# Altium project vestibular_vampire.PrjPcb (part 3 of 3)
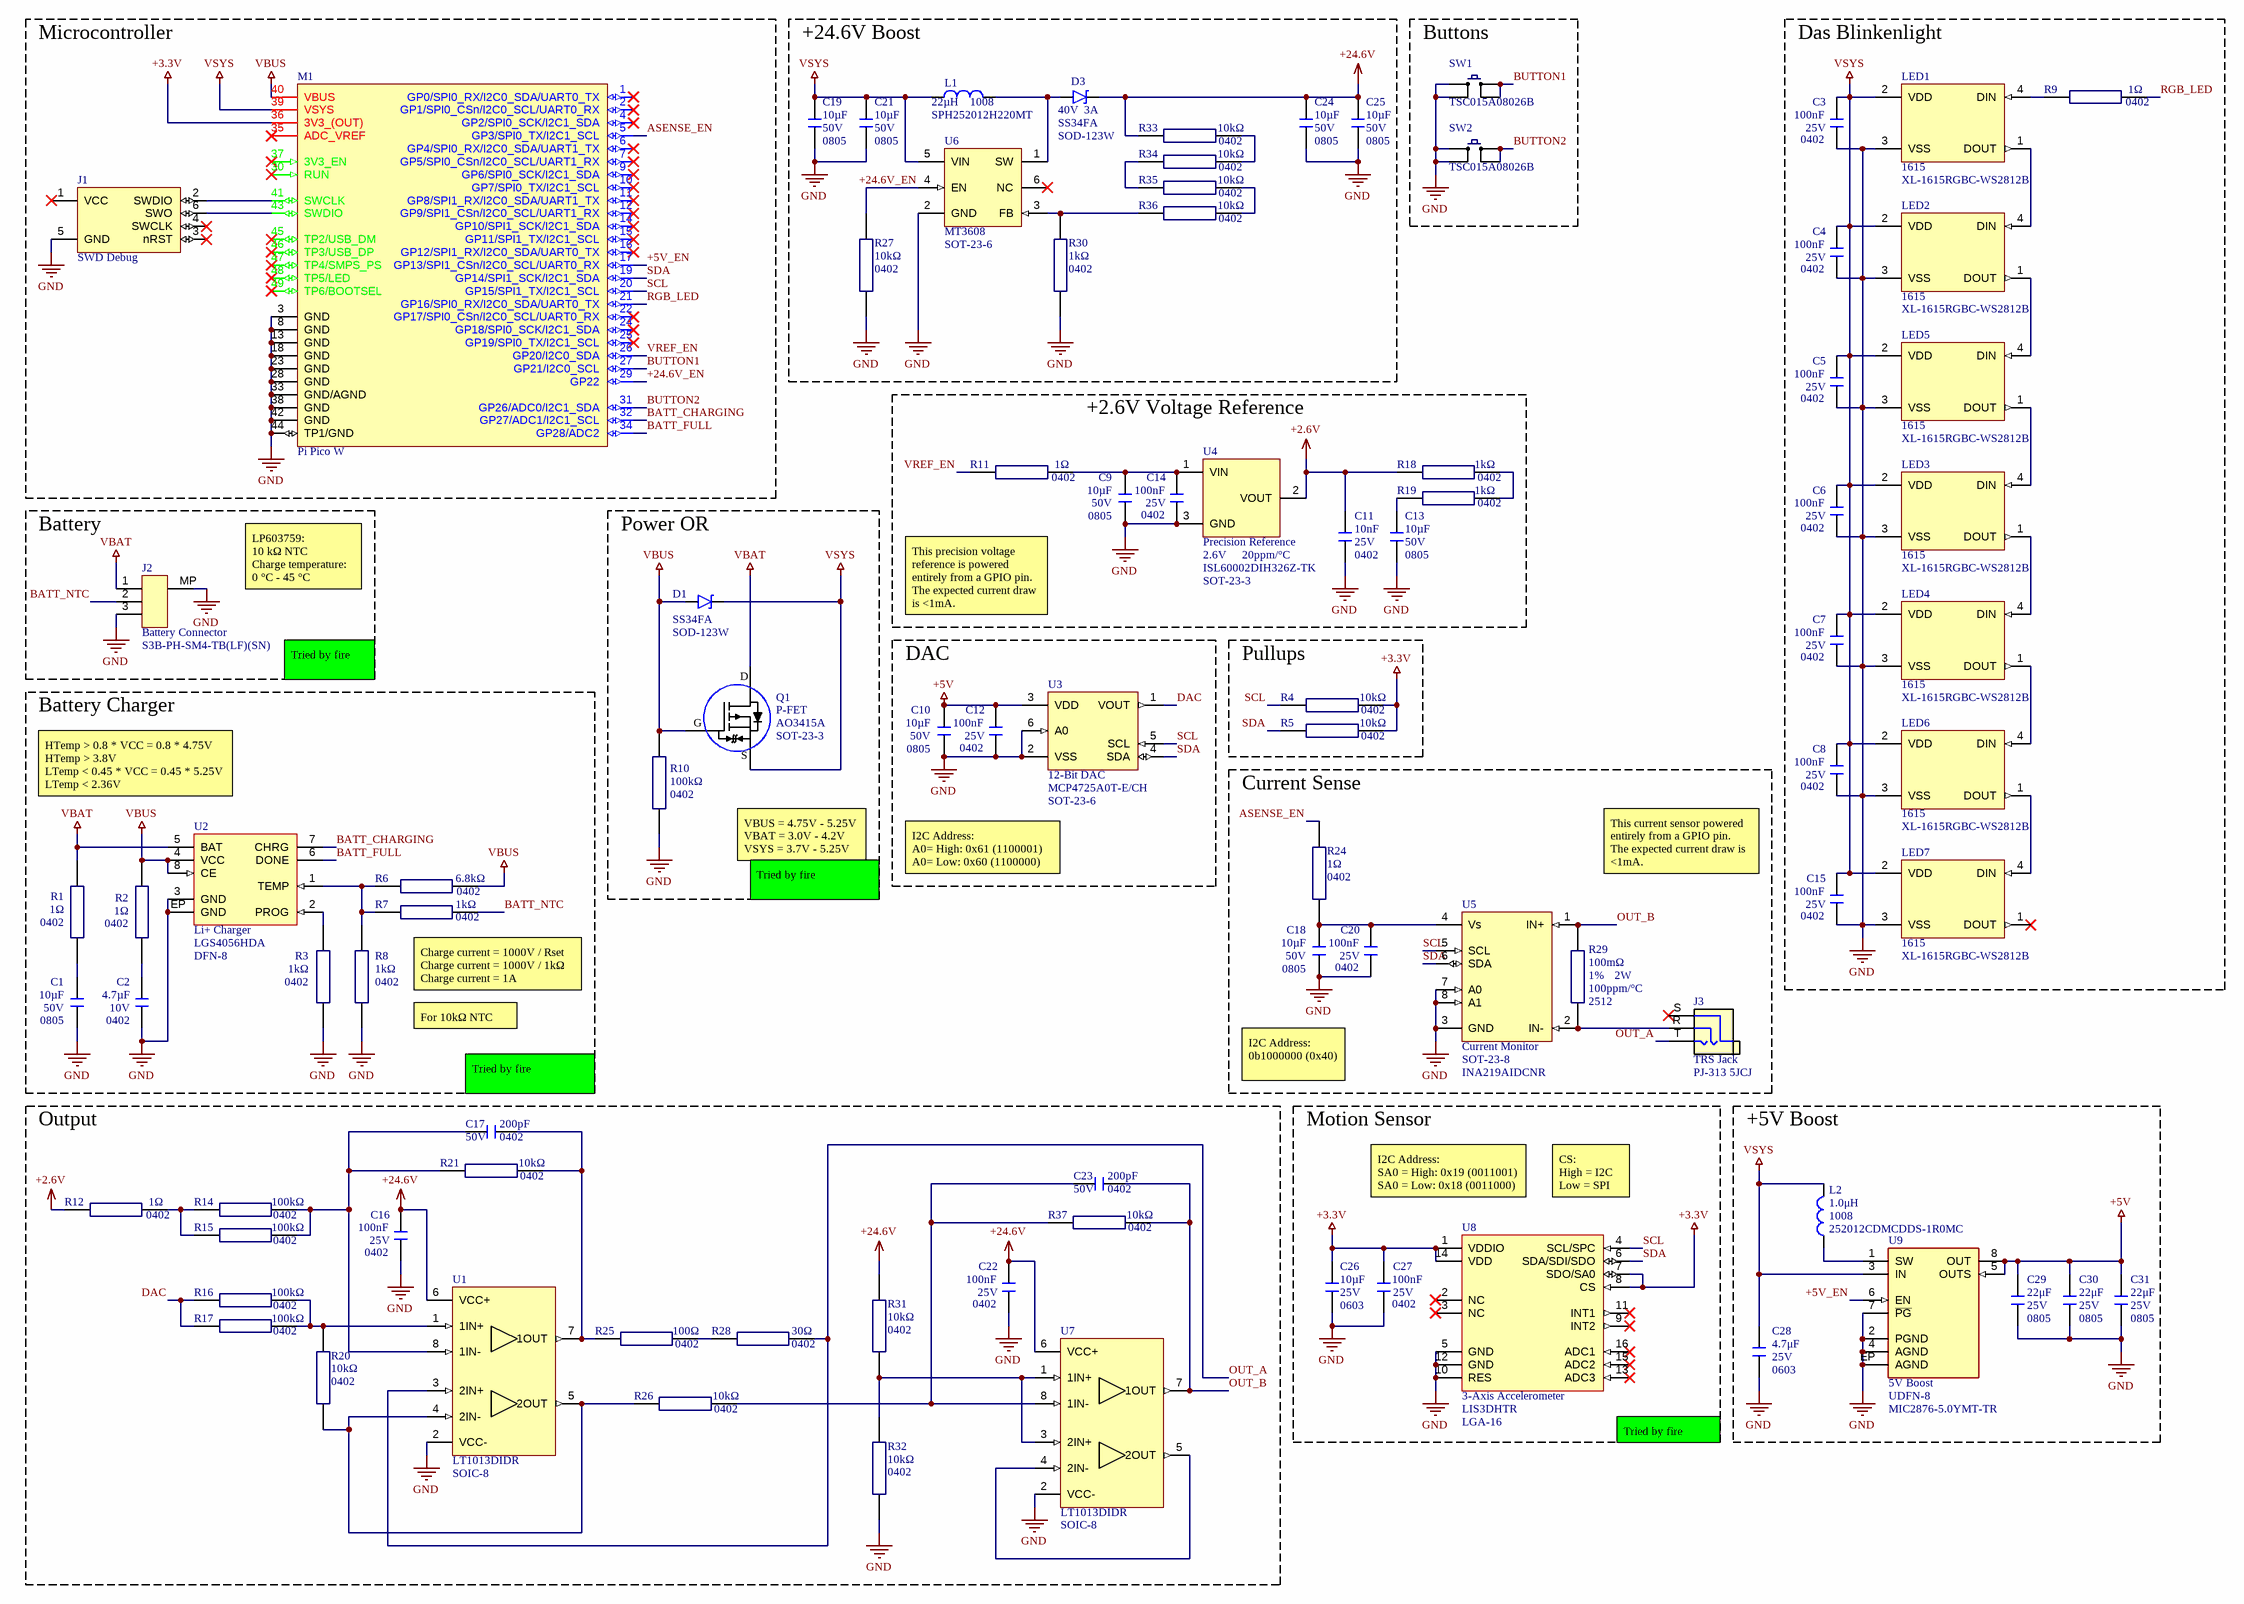
[diagram p2: vestibular_vampire.SchDoc]

## Sheet vestibular_vampire.SchDoc: Vestibular Vampire (continued)

### Library data of the parts (continued)
U1 U7 = LT1013DIDR: Op-Amp, 5-44 V, SOIC-8; Manufacturer: Texas Instruments; Manufacturer Lifecycle Status: ACTIVE; Bandwidth: 1MHz; Common Mode Rejection Ratio: 97dB; Input Bias Current: -15nA; Input Offset Voltage (Vos): 200µV; Max Dual Supply Voltage: 22V; Max Junction Temperature (Tj): 150°C; Max Supply Voltage: 30V; Min Dual Supply Voltage: 2V; Min Supply Voltage: 5V; Nominal Supply Current: 350µA; Number of Amplifiers: 2; Output Current per Channel: 25mA; Slew Rate: 0.4V/µs; Voltage Gain: 120dB; Supplier 1: LCSC; RoHS: Compliant; Category: Amplifiers - Op Amps, Buffer, Instrumentation; Stock 1: 2755; Pricing 1: 1=10.5871, 1=1.2745, 1=11.5575, 1=1.4483, 10=8.8042, 10=1.0599, 10=9.6112, 10=1.2044, 30=7.8217, 30=0.9416, 30=8.5386, 30=1.07, 100=6.7048, 100=0.8072, 100=7.3193, 100=0.9172, 500=6.2077, 500=0.7473, 500=6.7767, 500=0.8492, 1000=5.9935, 1000=0.7216, 1000=6.5428, 1000=0.8199 (CNY); Ambient Temperature Range High: 105°C; Contact Plating: Gold; Gain Bandwidth Product: 1MHz; Height: 1.75mm; Lead Free: Lead Free; Length: 4.9mm; Lifecycle Status: Production; Max Operating Temperature: 105°C; Min Operating Temperature: -40°C; Mounting Technology: Surface Mount; Number of Channels: 2; Number of Circuits: 2; Number of Elements: 2; Pins: 8; Operating Supply Current: 350µA; Operating Supply Voltage: 22V; Packaging: Cut Tape; Radiation Hardening: No; REACH SVHC: No; Schedule B: 8542330000, 8542330000|8542330000|8542330000|8542330000|8542330000; Thickness: 1.58mm; Width: 3.91mm; ComponentLink1URL: https://octopart.com:443/opatz8j6/c1?t=M0cShFGUicegvLtuJ8-zs80pXCwKzPiMDfXh6-JTafKhOGkvmMbrbDOg59FWK180Hgcjh15YrgijTlzM1MQuPq40am12GMlhmTgFy1qRP_KCXoXJDs106NH1KBLm8tXuipKWnQXtF43MTIKlBHKkohhW4hOkcw2aK72GO3jP4nGAq-PKP9ZyrZWAbdm3b52rhLG0hkAVfGKswW3joJ7vh5DhYPJWbTvPhAbR8fO8VPXhxLQM_jY_VT1wzAmnyheMOpOCMWHZ9EDcKaKFaiylEQig-uIOmFPvjOgFNBLduZO8eK__Uds4HhdSl55DCMz9u54MsLGNxZV-EWbAqBfnwHirGA5M-fHWLMAxe_jbIe9TaaBizE_qMUTQwbY40qDj2r7m&src-supplier=Texas+Instruments; ComponentLink1Description: https://octopart.com:443/opatz8j6/c1?t=M0cShFGUicegvLtuJ8-zs80pXCwKzPiMDfXh6-JTafKhOGkvmMbrbDOg59FWK180Hgcjh15YrgijTlzM1MQuPq40am12GMlhmTgFy1qRP_KCXoXJDs106NH1KBLm8tXuipKWnQXtF43MTIKlBHKkohhW4hOkcw2aK72GO3jP4nGAq-PKP9ZyrZWAbdm3b52rhLG0hkAVfGKswW3joJ7vh5DhYPJWbTvPhAbR8fO8VPXhxLQM_jY_VT1wzAmnyheMOpOCMWHZ9EDcKaKFaiylEQig-uIOmFPvjOgFNBLduZO8eK__Uds4HhdSl55DCMz9u54MsLGNxZV-EWbAqBfnwHirGA5M-fHWLMAxe_jbIe9TaaBizE_qMUTQwbY40qDj2r7m&src-supplier=Texas+Instruments; ComponentLink2URL: https://datasheet.octopart.com:443/LT1013DIDR-Texas-Instruments-datasheet-41214033.pdf?src-supplier=Texas+Instruments; ComponentLink2Description: https://datasheet.octopart.com:443/LT1013DIDR-Texas-Instruments-datasheet-41214033.pdf?src-supplier=Texas+Instruments; ComponentLink3URL: https://datasheet.octopart.com:443/LT1013DIDR-Texas-Instruments-datasheet-10254874.pdf?src-supplier=Texas+Instruments; ComponentLink3Description: https://datasheet.octopart.com:443/LT1013DIDR-Texas-Instruments-datasheet-10254874.pdf?src-supplier=Texas+Instruments; ComponentLink4URL: https://sigma.octopart.com:443/49249642/technical_drawing/Texas-Instruments-LT1013DIDR.pdf?src-supplier=Texas+Instruments; ComponentLink4Description: https://sigma.octopart.com:443/49249642/technical_drawing/Texas-Instruments-LT1013DIDR.pdf?src-supplier=Texas+Instruments; ComponentLink5URL: https://datasheet.octopart.com:443/LT1013DIDR-Texas-Instruments-datasheet-10254053.pdf?src-supplier=Texas+Instruments; ComponentLink5Description: https://datasheet.octopart.com:443/LT1013DIDR-Texas-Instruments-datasheet-10254053.pdf?src-supplier=Texas+Instruments; ComponentLink6URL: https://datasheet.octopart.com:443/LT1013DIDR-Texas-Instruments-datasheet-148846.pdf?src-supplier=Texas+Instruments; ComponentLink6Description: https://datasheet.octopart.com:443/LT1013DIDR-Texas-Instruments-datasheet-148846.pdf?src-supplier=Texas+Instruments; ComponentLink7URL: https://datasheet.octopart.com:443/LT1013DIDR-Texas-Instruments-datasheet-151281.pdf?src-supplier=Texas+Instruments; ComponentLink7Description: https://datasheet.octopart.com:443/LT1013DIDR-Texas-Instruments-datasheet-151281.pdf?src-supplier=Texas+Instruments; ComponentLink8URL: https://datasheet.octopart.com:443/LT1013DIDR-Texas-Instruments-datasheet-148794836.pdf?src-supplier=Upverter; ComponentLink8Description: https://datasheet.octopart.com:443/LT1013DIDR-Texas-Instruments-datasheet-148794836.pdf?src-supplier=Upverter; ComponentLink9URL: https://datasheet.octopart.com:443/LT1013DIDR-Texas-Instruments-datasheet-82285550.pdf?src-supplier=element14+APAC; ComponentLink9Description: https://datasheet.octopart.com:443/LT1013DIDR-Texas-Instruments-datasheet-82285550.pdf?src-supplier=element14+APAC; ComponentLink10URL: https://datasheet.octopart.com:443/LT1013DIDR.-Texas-Instruments-datasheet-33010526.pdf?src-supplier=element14+APAC; ComponentLink10Description: https://datasheet.octopart.com:443/LT1013DIDR.-Texas-Instruments-datasheet-33010526.pdf?src-supplier=element14+APAC; ComponentLink11URL: https://datasheet.octopart.com:443/LT1013DIDR-Texas-Instruments-datasheet-20866108.pdf?src-supplier=Newark; ComponentLink11Description: https://datasheet.octopart.com:443/LT1013DIDR-Texas-Instruments-datasheet-20866108.pdf?src-supplier=Newark; ComponentLink12URL: https://datasheet.octopart.com:443/LT1013DIDR-Texas-Instruments-datasheet-11521414.pdf?src-supplier=Newark; ComponentLink12Description: https://datasheet.octopart.com:443/LT1013DIDR-Texas-Instruments-datasheet-11521414.pdf?src-supplier=Newark; ComponentLink13URL: https://datasheet.octopart.com:443/LT1013DIDR-Texas-Instruments-datasheet-14138854.pdf?src-supplier=iiiC; ComponentLink13Description: https://datasheet.octopart.com:443/LT1013DIDR-Texas-Instruments-datasheet-14138854.pdf?src-supplier=iiiC; ComponentLink14URL: https://datasheet.octopart.com:443/LT1013DIDR-Texas-Instruments-datasheet-14436488.pdf?src-supplier=Factory+Futures; ComponentLink14Description: https://datasheet.octopart.com:443/LT1013DIDR-Texas-Instruments-datasheet-14436488.pdf?src-supplier=Factory+Futures; ComponentLink15URL: https://datasheet.octopart.com:443/LT1013DIDR-Texas-Instruments-datasheet-8205012.pdf?src-supplier=Jameco; ComponentLink15Description: https://datasheet.octopart.com:443/LT1013DIDR-Texas-Instruments-datasheet-8205012.pdf?src-supplier=Jameco; ComponentLink16URL: https://datasheet.octopart.com:443/LT1013DIDR-Texas-Instruments-datasheet-9056.pdf?src-supplier=DigiKey; ComponentLink16Description: https://datasheet.octopart.com:443/LT1013DIDR-Texas-Instruments-datasheet-9056.pdf?src-supplier=DigiKey; ComponentLink17URL: http://sigma.octopart.com:80/conflict_mineral_statement/Texas-Instruments-company-63.pdf?src-supplier=Compliance+Statements; ComponentLink17Description: http://sigma.octopart.com:80/conflict_mineral_statement/Texas-Instruments-company-63.pdf?src-supplier=Compliance+Statements; ComponentLink18URL: http://sigma.octopart.com:80/reach_statement/Texas-Instruments-company-64.pdf?src-supplier=Compliance+Statements; ComponentLink18Description: http://sigma.octopart.com:80/reach_statement/Texas-Instruments-company-64.pdf?src-supplier=Compliance+Statements; Supplier Part Number 1: C177140; Manufacturer Part Number: LT1013DIDR
U2 = LGS4056H: Battery Charger, DFN-8(2x2); Case/Package: DFN-8(2x2); Supplier 1: LCSC; house_part_number: LGS4056HDA; Supplier Part Number 1: C5124109
U3 = MCP4725A0T-E/CH: DAC, 12-bit, SOT-23-6; Manufacturer: Microchip; Manufacturer Package Identifier: C04-028-CHY; Input Offset Voltage (Vos): 1.1mV; Integral Nonlinearity (INL): 14.5LSB; Interface: I2C; Max Junction Temperature (Tj): 150°C; Max Supply Voltage: 5.5V; Min Supply Voltage: 2.7V; Nominal Supply Current: 210µA; Number of Bits: 12; Number of Channels: 1; Output Type: Voltage; Polarity: Unipolar; Resolution: 1.5B; Settling Time: 6µs; Supply Type: Single; Supplier 1: LCSC; RoHS: Compliant; Category: Digital to Analog Converters (DACs); Stock 1: 11398; Pricing 1: 1=6.7252, 1=0.8004, 1=7.3416, 1=0.92, 10=5.9073, 10=0.7031, 10=6.4487, 10=0.8081, 30=5.1339, 30=0.611, 30=5.6044, 30=0.7023, 100=4.5622, 100=0.543, 100=4.9804, 100=0.6241, 500=4.3268, 500=0.515, 500=4.7234, 500=0.5919, 1000=4.2033, 1000=0.5003, 1000=4.5885, 1000=0.575 (CNY); Projected EOL Date: 2034-10-26; Ambient Temperature Range High: 125°C; Contact Plating: Tin; Country of Assembly: Thailand; Country of Fabrication: United States of America; Country of Origin: Thailand; Export Control Classification Number (ECCN) Code: EAR99; Height: 1.45mm; Harmonized Tariff Schedule (HTS) Code: 8542.39.0040; Introduction Date: 2007-10-26; Lead Free: Lead Free; Length: 3.1mm; Lifecycle Status: Production; Max Operating Temperature: 125°C; Min Operating Temperature: -40°C; Mounting Technology: Surface Mount; Number of Converters: 1; Number of D/A Converters: 1; Number of DAC Channels: 1; Number of Outputs: 1; Pins: 6; Packaging: Cut Tape; Radiation Hardening: No; REACH SVHC: No; Schedule B: 8542390000, 8542390000|8542390000|8542390000|8542390000|8542390000; Termination: SMD/SMT; Width: 1.8mm; ComponentLink1URL: https://datasheet.octopart.com:443/MCP4725A0T-E/CH-Microchip-datasheet-11052695.pdf?src-supplier=SHENGYU+ELECTRONICS; ComponentLink1Description: https://datasheet.octopart.com:443/MCP4725A0T-E/CH-Microchip-datasheet-11052695.pdf?src-supplier=SHENGYU+ELECTRONICS; ComponentLink2URL: https://datasheet.octopart.com:443/MCP4725A0T-E/CH-Microchip-datasheet-660622.pdf?src-supplier=Electro+Sonic; ComponentLink2Description: https://datasheet.octopart.com:443/MCP4725A0T-E/CH-Microchip-datasheet-660622.pdf?src-supplier=Electro+Sonic; ComponentLink3URL: https://datasheet.octopart.com:443/MCP4725A0T-E-CH-Microchip-datasheet-175858725.pdf?src-supplier=Microchip; ComponentLink3Description: https://datasheet.octopart.com:443/MCP4725A0T-E-CH-Microchip-datasheet-175858725.pdf?src-supplier=Microchip; ComponentLink4URL: https://datasheet.octopart.com:443/MCP4725A0T-E-CH-Microchip-datasheet-140568178.pdf?src-supplier=Arrow.cn; ComponentLink4Description: https://datasheet.octopart.com:443/MCP4725A0T-E-CH-Microchip-datasheet-140568178.pdf?src-supplier=Arrow.cn; ComponentLink5URL: https://datasheet.octopart.com:443/MCP4725A0T-E-CH-Microchip-datasheet-166018867.pdf?src-supplier=Augswan; ComponentLink5Description: https://datasheet.octopart.com:443/MCP4725A0T-E-CH-Microchip-datasheet-166018867.pdf?src-supplier=Augswan; ComponentLink6URL: http://sigma.octopart.com:80/188449425/materials_sheet/Microchip-MCP4725A0T-E-CH.pdf?src-supplier=Compliance+Statements; ComponentLink6Description: http://sigma.octopart.com:80/188449425/materials_sheet/Microchip-MCP4725A0T-E-CH.pdf?src-supplier=Compliance+Statements; ComponentLink7URL: http://sigma.octopart.com:80/conflict_mineral_statement/Microchip-company-68.pdf?src-supplier=Compliance+Statements; ComponentLink7Description: http://sigma.octopart.com:80/conflict_mineral_statement/Microchip-company-68.pdf?src-supplier=Compliance+Statements; ComponentLink8URL: http://sigma.octopart.com:80/conflict_mineral_statement/Microchip-company-69.pdf?src-supplier=Compliance+Statements; ComponentLink8Description: http://sigma.octopart.com:80/conflict_mineral_statement/Microchip-company-69.pdf?src-supplier=Compliance+Statements; ComponentLink9URL: http://sigma.octopart.com:80/reach_statement/Microchip-company-70.pdf?src-supplier=Compliance+Statements; ComponentLink9Description: http://sigma.octopart.com:80/reach_statement/Microchip-company-70.pdf?src-supplier=Compliance+Statements; ComponentLink10URL: http://sigma.octopart.com:80/rohs_statement/Microchip-company-71.pdf?src-supplier=Compliance+Statements; ComponentLink10Description: http://sigma.octopart.com:80/rohs_statement/Microchip-company-71.pdf?src-supplier=Compliance+Statements; Supplier Part Number 1: C144198; Manufacturer Part Number: MCP4725A0T-E/CH
U4 = ISL60002DIH326Z-TK: 2.6 V, ±5.0mV, 20ppm/°C, 7 mA Precision Voltage Reference, SOT-23-3; Manufacturer: Renesas; Manufacturer Lifecycle Status: ACTIVE; Max Supply Voltage: 5.5V; Max Output current: 7mA; Max Supply Current: 900nA; Min Input Voltage: 2.8V; Min Output Voltage: -2.4V; Number of Circuits: 1; Operating Supply Voltage: 3V; Output Type: Fixed; Pitch: 0m; Reference Type: Series; Tolerance: 0.19%; Supplier 1: LCSC; RoHS: Compliant; Category: Voltage References; Stock 1: 50; Pricing 1: 1=17.1493, 1=2.0645, 1=18.7211, 1=2.346, 10=16.7772, 10=2.0197, 10=18.3149, 10=2.2951, 30=16.5287, 30=1.9898, 30=18.0436, 30=2.2611, 100=16.2801, 100=1.9599, 100=17.7723, 100=2.2271 (CNY); Export Control Classification Number (ECCN) Code: EAR99; Part Family: ISL60002DIH326; Height: 0m; Height - Seated (Max): 1.12mm; Harmonized Tariff Schedule (HTS) Code: 8540000000; Length: 2.9mm; Lifecycle Status: Production; Max Operating Temperature: 85°C; Max Output Voltage: 2.6V; Min Operating Temperature: -40°C; Min Supply Voltage: 2.8V; MSL: 1; Mounting Technology: Surface Mount; Nominal Output Voltage: 2.6V; Number of Outputs: 1; Pins: 3; Number of Terminals: 3; Operating Supply Current: 900nA; Output Current: 7mA; Output Voltage: 2.6V; Radiation Hardening: No; REACH SVHC: Yes; Terminal Pitch: 950µm; Width: 1.3mm; ComponentLink1URL: https://datasheet.octopart.com:443/ISL60002DIH326Z-TK-Renesas-datasheet-181194884.pdf?src-supplier=IHS; ComponentLink1Description: https://datasheet.octopart.com:443/ISL60002DIH326Z-TK-Renesas-datasheet-181194884.pdf?src-supplier=IHS; ComponentLink2URL: https://datasheet.octopart.com:443/ISL60002DIH326Z-TK-Intersil-datasheet-93396614.pdf?src-supplier=IHS; ComponentLink2Description: https://datasheet.octopart.com:443/ISL60002DIH326Z-TK-Intersil-datasheet-93396614.pdf?src-supplier=IHS; ComponentLink3URL: https://datasheet.octopart.com:443/ISL60002DIH326Z-TK-Renesas-datasheet-179182157.pdf?src-supplier=Integrated+Device+Technology; ComponentLink3Description: https://datasheet.octopart.com:443/ISL60002DIH326Z-TK-Renesas-datasheet-179182157.pdf?src-supplier=Integrated+Device+Technology; ComponentLink4URL: https://datasheet.octopart.com:443/ISL60002DIH326Z-TK-Renesas-datasheet-149187340.pdf?src-supplier=Integrated+Device+Technology; ComponentLink4Description: https://datasheet.octopart.com:443/ISL60002DIH326Z-TK-Renesas-datasheet-149187340.pdf?src-supplier=Integrated+Device+Technology; ComponentLink5URL: https://datasheet.octopart.com:443/ISL60002DIH326Z-TK-Renesas-datasheet-137927834.pdf?src-supplier=Renesas; ComponentLink5Description: https://datasheet.octopart.com:443/ISL60002DIH326Z-TK-Renesas-datasheet-137927834.pdf?src-supplier=Renesas; ComponentLink6URL: https://datasheet.octopart.com:443/ISL60002DIH326Z-TK-Intersil-datasheet-11480143.pdf?src-supplier=Newark; ComponentLink6Description: https://datasheet.octopart.com:443/ISL60002DIH326Z-TK-Intersil-datasheet-11480143.pdf?src-supplier=Newark; ComponentLink7URL: https://datasheet.octopart.com:443/ISL60002DIH326Z-TK-Renesas-datasheet-23692053.pdf?src-supplier=Future+Electronics; ComponentLink7Description: https://datasheet.octopart.com:443/ISL60002DIH326Z-TK-Renesas-datasheet-23692053.pdf?src-supplier=Future+Electronics; ComponentLink8URL: http://sigma.octopart.com:80/conflict_mineral_statement/Renesas-company-44.pdf?src-supplier=Compliance+Statements; ComponentLink8Description: http://sigma.octopart.com:80/conflict_mineral_statement/Renesas-company-44.pdf?src-supplier=Compliance+Statements; ComponentLink9URL: http://sigma.octopart.com:80/reach_statement/Renesas-company-45.pdf?src-supplier=Compliance+Statements; ComponentLink9Description: http://sigma.octopart.com:80/reach_statement/Renesas-company-45.pdf?src-supplier=Compliance+Statements; Supplier Part Number 1: C152385; Manufacturer Part Number: ISL60002DIH326Z-TK
U5 = INA219AIDCNR: 12-bit, 26 V, Current monitor, SOT-23-8; Manufacturer: Texas Instruments; Manufacturer Lifecycle Status: ACTIVE; Accuracy: 1%; Bandwidth: 3.4MHz; Common Mode Rejection Ratio: 100dB; Input Offset Voltage (Vos): 100µV; Max Supply Voltage: 26V; Max Junction Temperature (Tj): 150°C; Max Supply Current: 5mA; Min Input Voltage: 0V; Min Supply Voltage: 3V; Nominal Supply Current: 700µA; Number of Amplifiers: 1; Operating Supply Current: 1mA; Output Current: 10mA; Output Type: Digital; Supplier 1: LCSC; RoHS: Compliant; Category: Amplifiers - Op Amps, Buffer, Instrumentation; Stock 1: 20380; Pricing 1: 1=4.0454, 1=0.4815, 1=4.4162, 1=0.5534, 10=3.3809, 10=0.4024, 10=3.6908, 10=0.4625, 30=2.9072, 30=0.346, 30=3.1737, 30=0.3977, 100=2.5132, 100=0.2992, 100=2.7436, 100=0.3438, 500=2.389, 500=0.2844, 500=2.6079, 500=0.3268, 1000=2.3217, 1000=0.2764, 1000=2.5345, 1000=0.3176 (CNY); Ambient Temperature Range High: 85°C; Contact Plating: Gold; Features: I²C; Height: 1.45mm; Lead Free: Lead Free; Length: 2.9mm; Lifecycle Status: Production; Max Operating Temperature: 125°C; Min Operating Temperature: -40°C; Number of Outputs: 1; Pins: 8; Output Current per Channel: 10mA; Packaging: Cut Tape; Quiescent Current: 700µA; Radiation Hardening: No; REACH SVHC: No; Schedule B: 8542330000|8542330000|8542330000, 8542330000|8542330000|8542330000|8542330000|8542330000; Thickness: 1.1mm; Weight: 40.001177mg; Width: 1.63mm; ComponentLink1URL: https://octopart.com:443/opatz8j6/c1?t=DVq09uJr_YdfZ3FRpbOBgPun56EVh337pP3YmMsMgBQtNH6hRcAHRUvxGerFQEBV7m1HzARORBc_wP6s1K2TllUe8djZ8D3A50dxM-TXm_1WtZGsSs9rKauk-HQpUDSZf4lUPI62nM8LWJt3msp5UKlwZreW95VyiTJ2Dr4WnsefFfByjfz4Pr-XpEVfgU679EhLe0aST7zwMe-5YuyqqsAtxcCLEgrONwdDej-2clXOK-cBRd3NGZmje8a8QhigDDw02IpOoivKjdM1wlIeKQ4WXXxBl5NHv561hpyEZKyv6NAKwXJkcYig7bt9qUrtqQLjmPafQrnLdjIA2W2dMCJI4l2lGR1WvT7_B070DjUZK-9N8JxxLah7jZa2Tv7ownM&src-supplier=Texas+Instruments; ComponentLink1Description: https://octopart.com:443/opatz8j6/c1?t=DVq09uJr_YdfZ3FRpbOBgPun56EVh337pP3YmMsMgBQtNH6hRcAHRUvxGerFQEBV7m1HzARORBc_wP6s1K2TllUe8djZ8D3A50dxM-TXm_1WtZGsSs9rKauk-HQpUDSZf4lUPI62nM8LWJt3msp5UKlwZreW95VyiTJ2Dr4WnsefFfByjfz4Pr-XpEVfgU679EhLe0aST7zwMe-5YuyqqsAtxcCLEgrONwdDej-2clXOK-cBRd3NGZmje8a8QhigDDw02IpOoivKjdM1wlIeKQ4WXXxBl5NHv561hpyEZKyv6NAKwXJkcYig7bt9qUrtqQLjmPafQrnLdjIA2W2dMCJI4l2lGR1WvT7_B070DjUZK-9N8JxxLah7jZa2Tv7ownM&src-supplier=Texas+Instruments; ComponentLink2URL: https://datasheet.octopart.com:443/INA219AIDCNR-Texas-Instruments-datasheet-10383171.pdf?src-supplier=Texas+Instruments; ComponentLink2Description: https://datasheet.octopart.com:443/INA219AIDCNR-Texas-Instruments-datasheet-10383171.pdf?src-supplier=Texas+Instruments; ComponentLink3URL: https://datasheet.octopart.com:443/INA219AIDCNR-Texas-Instruments-datasheet-10258484.pdf?src-supplier=Texas+Instruments; ComponentLink3Description: https://datasheet.octopart.com:443/INA219AIDCNR-Texas-Instruments-datasheet-10258484.pdf?src-supplier=Texas+Instruments; ComponentLink4URL: https://sigma.octopart.com:443/49252122/technical_drawing/Texas-Instruments-INA219AIDCNR.pdf?src-supplier=Texas+Instruments; ComponentLink4Description: https://sigma.octopart.com:443/49252122/technical_drawing/Texas-Instruments-INA219AIDCNR.pdf?src-supplier=Texas+Instruments; ComponentLink5URL: https://datasheet.octopart.com:443/INA219AIDCNR-Texas-Instruments-datasheet-102489495.pdf?src-supplier=Upverter; ComponentLink5Description: https://datasheet.octopart.com:443/INA219AIDCNR-Texas-Instruments-datasheet-102489495.pdf?src-supplier=Upverter; ComponentLink6URL: https://datasheet.octopart.com:443/INA219AIDCNR-Texas-Instruments-datasheet-11538655.pdf?src-supplier=Future+Electronics; ComponentLink6Description: https://datasheet.octopart.com:443/INA219AIDCNR-Texas-Instruments-datasheet-11538655.pdf?src-supplier=Future+Electronics; ComponentLink7URL: https://datasheet.octopart.com:443/INA219AIDCNR-Texas-Instruments-datasheet-137316104.pdf?src-supplier=Future+Electronics; ComponentLink7Description: https://datasheet.octopart.com:443/INA219AIDCNR-Texas-Instruments-datasheet-137316104.pdf?src-supplier=Future+Electronics; ComponentLink8URL: https://datasheet.octopart.com:443/INA219AIDCNR-Texas-Instruments-datasheet-24897021.pdf?src-supplier=element14+APAC; ComponentLink8Description: https://datasheet.octopart.com:443/INA219AIDCNR-Texas-Instruments-datasheet-24897021.pdf?src-supplier=element14+APAC; ComponentLink9URL: https://datasheet.octopart.com:443/INA219AIDCNR.-Texas-Instruments-datasheet-62277359.pdf?src-supplier=element14+APAC; ComponentLink9Description: https://datasheet.octopart.com:443/INA219AIDCNR.-Texas-Instruments-datasheet-62277359.pdf?src-supplier=element14+APAC; ComponentLink10URL: https://datasheet.octopart.com:443/INA219AIDCNR-Texas-Instruments-datasheet-164414650.pdf?src-supplier=SHENGYU+ELECTRONICS; ComponentLink10Description: https://datasheet.octopart.com:443/INA219AIDCNR-Texas-Instruments-datasheet-164414650.pdf?src-supplier=SHENGYU+ELECTRONICS; ComponentLink11URL: https://datasheet.octopart.com:443/INA219AIDCNR-Texas-Instruments-datasheet-159115060.pdf?src-supplier=LCSC; ComponentLink11Description: https://datasheet.octopart.com:443/INA219AIDCNR-Texas-Instruments-datasheet-159115060.pdf?src-supplier=LCSC; ComponentLink12URL: https://datasheet.octopart.com:443/INA219AIDCNR-Texas-Instruments-datasheet-140571431.pdf?src-supplier=Arrow.cn; ComponentLink12Description: https://datasheet.octopart.com:443/INA219AIDCNR-Texas-Instruments-datasheet-140571431.pdf?src-supplier=Arrow.cn; ComponentLink13URL: https://datasheet.octopart.com:443/INA219AIDCNR-Texas-Instruments-datasheet-14155040.pdf?src-supplier=iiiC; ComponentLink13Description: https://datasheet.octopart.com:443/INA219AIDCNR-Texas-Instruments-datasheet-14155040.pdf?src-supplier=iiiC; ComponentLink14URL: http://sigma.octopart.com:80/conflict_mineral_statement/Texas-Instruments-company-63.pdf?src-supplier=Compliance+Statements; ComponentLink14Description: http://sigma.octopart.com:80/conflict_mineral_statement/Texas-Instruments-company-63.pdf?src-supplier=Compliance+Statements; ComponentLink15URL: http://sigma.octopart.com:80/reach_statement/Texas-Instruments-company-64.pdf?src-supplier=Compliance+Statements; ComponentLink15Description: http://sigma.octopart.com:80/reach_statement/Texas-Instruments-company-64.pdf?src-supplier=Compliance+Statements; Supplier Part Number 1: C87469; Case/Package: SOT-23-8; Manufacturer Part Number: INA219AIDCNR
U6 = MT3608: Boost converter, 2A, SOT-23-6; Supplier Part Number: C84817; Manufacturer Part Number: MT3608
U8 = LIS3DHTR: 3-Axis accelerometer, 16-bit, I2C/SPI, LGA-16; Manufacturer: STMicroelectronics; Max Supply Voltage: 3.6V; Min Supply Voltage: 1.71V; Operating Supply Voltage: 2.5V; Bandwidth: 5kHz; Interface: I2C,SPI; Resolution: 16b; Operating Supply Current: 11uA; Sensor Type: 3 Axis; Output Type: Digital; Axis: X, Y, Z; Supplier: Avnet; Supplier Part Number: LIS3DHTR; RoHS: Yes; Category: Accelerometers; Stock: 40000; Pricing: 4000=0.94095, 8000=0.92155, 16000=0.90215 (USD); Pins: 16; Min Operating Temperature: -40°C; Max Operating Temperature: 85°C; Package Quantity: 4000; Packaging: Tape and Reel; Max Supply Voltage (DC): 3.6V; Min Supply Voltage (DC): 1.71V; Series: -; Length: 3mm; Width: 3mm; Height: 1mm; Depth: 3mm; Radiation Hardening: No; Reach SVHC Compliant: No; Lead Free: Lead Free; RoHS Compliant: Yes; ComponentLink1URL: https://datasheet.ciiva.com/7621/1718591-7621744.pdf?src-supplier=Element14; ComponentLink1Description: https://datasheet.ciiva.com/7621/1718591-7621744.pdf?src-supplier=Element14; ComponentLink2URL: https://datasheet.ciiva.com/5296/cd00274221-117431-5296513.pdf?src-supplier=Mouser; ComponentLink2Description: https://datasheet.ciiva.com/5296/cd00274221-117431-5296513.pdf?src-supplier=Mouser; ComponentLink3URL: https://datasheet.ciiva.com/2810/cd00274221-2810009.pdf?src-supplier=Digikey; ComponentLink3Description: https://datasheet.ciiva.com/2810/cd00274221-2810009.pdf?src-supplier=Digikey; ComponentLink4URL: https://datasheet.ciiva.com/2810/cd00274221-2810008.pdf?src-supplier=Digikey; ComponentLink4Description: https://datasheet.ciiva.com/2810/cd00274221-2810008.pdf?src-supplier=Digikey; ComponentLink5URL: https://datasheet.ciiva.com/2810/cd00274221-2810010.pdf?src-supplier=Digikey; ComponentLink5Description: https://datasheet.ciiva.com/2810/cd00274221-2810010.pdf?src-supplier=Digikey; ComponentLink6URL: https://datasheet.ciiva.com/48495/cd00274221-48495849.pdf?src-supplier=Avnet; ComponentLink6Description: https://datasheet.ciiva.com/48495/cd00274221-48495849.pdf?src-supplier=Avnet; ComponentLink7URL: https://datasheet.ciiva.com/3271/cd00274221-3271807.pdf?src-supplier=Avnet; ComponentLink7Description: https://datasheet.ciiva.com/3271/cd00274221-3271807.pdf?src-supplier=Avnet; ComponentLink8URL: https://datasheet.ciiva.com/16216/cd00274221-16216362.pdf?src-supplier=Future+Electronics; ComponentLink8Description: https://datasheet.ciiva.com/16216/cd00274221-16216362.pdf?src-supplier=Future+Electronics; Manufacturer Part Number: LIS3DHTR; house_part_number: LIS3DHTR; Supplier 1: LCSC; Supplier Part Number 1: C15134
U9 = MIC2876-5.0YMT-TR: 5V Synchronous Boost, UDFN-8; Manufacturer: Microchip; Number of Outputs: 1; Min Input Voltage: 2.5V; Max Supply Voltage: 5.5V; Output Current: 3.8A; Switching Frequency: 2MHz; Synchronous Rectifier: No; Output Type: Fixed; Output Configuration: Positive; Supplier: Digikey; Supplier Part Number: 150-MIC2876-5.0YMT-TRCT-ND; RoHS: Yes; Category: Voltage Regulators - Switching; Stock: 6514; Pricing: 1=0.97, 25=0.8, 100=0.73, 5000=0.73 (USD); Mounting Technology: Surface Mount; Min Operating Temperature: -40°C; Max Operating Temperature: 125°C; Packaging: Tape and Reel; Min Output Voltage: 5V; Topology: Boost; Series: -; RoHS Compliant: Yes; ComponentLink1URL: http://www.microchip.com/mymicrochip/filehandler.aspx?ddocname=en580787&src-supplier=Digikey; ComponentLink1Description: http://www.microchip.com/mymicrochip/filehandler.aspx?ddocname=en580787&src-supplier=Digikey; ComponentLink2URL: https://datasheet.octopart.com/MIC2876-5.0YMT-TR-Microchip-datasheet-175858781.pdf?src-supplier=Electro+Sonic; ComponentLink2Description: https://datasheet.octopart.com/MIC2876-5.0YMT-TR-Microchip-datasheet-175858781.pdf?src-supplier=Electro+Sonic; ComponentLink3URL: https://datasheet.octopart.com/MIC2876-5.0YMT-TR-Microchip-datasheet-175858781.pdf?src-supplier=microchipDIRECT; ComponentLink3Description: https://datasheet.octopart.com/MIC2876-5.0YMT-TR-Microchip-datasheet-175858781.pdf?src-supplier=microchipDIRECT; ComponentLink4URL: https://datasheet.octopart.com/MIC2876-5.0YMT-TR-Microchip-datasheet-175858781.pdf?src-supplier=Master+Electronics; ComponentLink4Description: https://datasheet.octopart.com/MIC2876-5.0YMT-TR-Microchip-datasheet-175858781.pdf?src-supplier=Master+Electronics; ComponentLink5URL: https://datasheet.octopart.com/MIC2876-5.0YMT-TR-Microchip-datasheet-86810323.pdf?src-supplier=SHENGYU+ELECTRONICS; ComponentLink5Description: https://datasheet.octopart.com/MIC2876-5.0YMT-TR-Microchip-datasheet-86810323.pdf?src-supplier=SHENGYU+ELECTRONICS; ComponentLink6URL: https://datasheet.octopart.com/MIC2876-5.0YMT-TR-Microchip-datasheet-142675560.pdf?src-supplier=TME; ComponentLink6Description: https://datasheet.octopart.com/MIC2876-5.0YMT-TR-Microchip-datasheet-142675560.pdf?src-supplier=TME; Manufacturer Part Number: MIC2876-5.0YMT-TR

## Assembly variants
default_variant: not fitted D? R? R?